# EAGLE design scr_precharge (EAGLE 7.6.0)
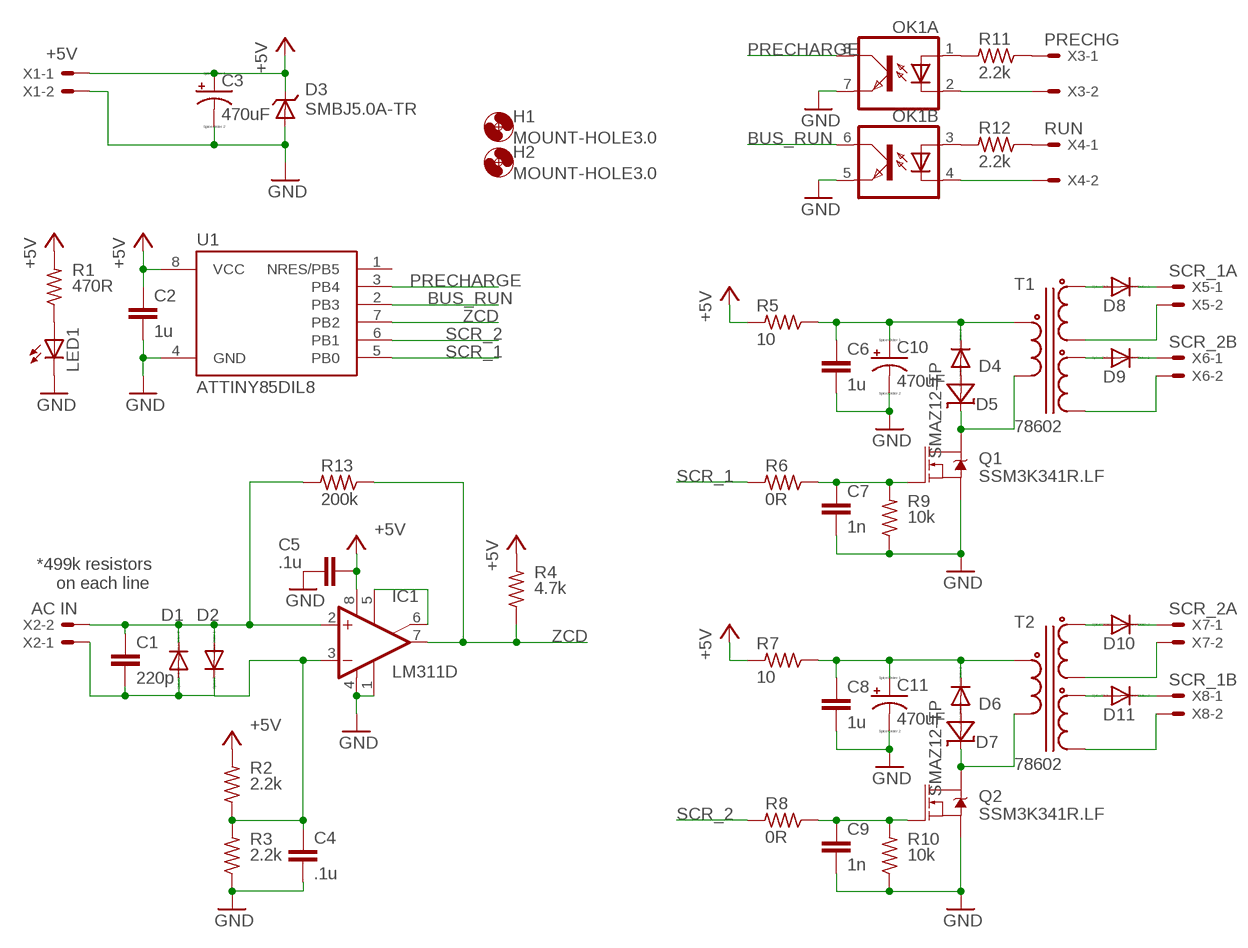
[diagram p0: schematic, sheet 1]

## Parts
C1  220p  C-EUC0805  [C0805]
C2  1u  C-EUC0805  [C0805]
C3  470uF  CPOL-USE3.5-8  [E3,5-8]
C4  .1u  C-EUC0805  [C0805]
C5  .1u  C-EUC0805  [C0805]
C6  1u  C-EUC0805  [C0805]
C7  1n  C-EUC0805  [C0805]
C8  1u  C-EUC0805  [C0805]
C9  1n  C-EUC0805  [C0805]
C10  470uF  CPOL-USE3.5-8  [E3,5-8]
C11  470uF  CPOL-USE3.5-8  [E3,5-8]
D1  1N4148MICROMELF  [MICROMELF-W]
D2  1N4148MICROMELF  [MICROMELF-W]
D3  SMBJ5.0A-TR  [DO214AA]
D4  1N4148MICROMELF  [MICROMELF-W]
D5  SMAZ12-TP  [DO-214AC]
D6  1N4148MICROMELF  [MICROMELF-W]
D7  SMAZ12-TP  [DO-214AC]
D8  1N4148MICROMELF  [MICROMELF-W]
D9  1N4148MICROMELF  [MICROMELF-W]
D10  1N4148MICROMELF  [MICROMELF-W]
D11  1N4148MICROMELF  [MICROMELF-W]
H1  MOUNT-HOLE3.0  [3,0]
H2  MOUNT-HOLE3.0  [3,0]
IC1  LM311D  [SO08]
LED1  LEDCHIP-LED0805  [CHIP-LED0805]
OK1  ILD621  [DIL08]
Q1  SSM3K341R.LF  MOSFET-NCH-AO3404A  [SOT23-3]
Q2  SSM3K341R.LF  MOSFET-NCH-AO3404A  [SOT23-3]
R1  470R  R-US_R0805  [R0805]
R2  2.2k  R-US_R0805  [R0805]
R3  2.2k  R-US_R0805  [R0805]
R4  4.7k  R-US_R0805  [R0805]
R5  10  R-US_R2010  [R2010]
R6  0R  R-US_R0805  [R0805]
R7  10  R-US_R2010  [R2010]
R8  0R  R-US_R0805  [R0805]
R9  10k  R-US_R0805  [R0805]
R10  10k  R-US_R0805  [R0805]
R11  2.2k  R-US_R0805  [R0805]
R12  2.2k  R-US_R0805  [R0805]
R13  200k  R-US_R0805  [R0805]
T1  78602  [J-STD-020D]
T2  78602  [J-STD-020D]
U1  ATTINY85DIL8  [DIL8]
X1  +5V  22-23-2021  [22-23-2021]
X2  AC IN  22-23-2021  [22-23-2021]
X3  PRECHG  22-23-2021  [22-23-2021]
X4  RUN  22-23-2021  [22-23-2021]
X5  SCR_1A  22-23-2021  [22-23-2021]
X6  SCR_2B  22-23-2021  [22-23-2021]
X7  SCR_2A  22-23-2021  [22-23-2021]
X8  SCR_1B  22-23-2021  [22-23-2021]

## Nets
+5V: C2.1 C3.+ C5.2 D3.C IC1.8(V+) R1.2 R2.2 R4.2 R5.2 R7.2 U1.8(VCC) X1.1
BUS_RUN: OK1.6(B:COL) U1.2(PB3)
GND: C2.2 C3.- C4.2 C5.1 C6.2 C7.2 C8.2 C9.2 C10.- C11.- D3.A IC1.1(GND) IC1.4(V-) LED1.C OK1.5(B:EMIT) OK1.7(A:EMIT) Q1.2(S) Q2.2(S) R3.1 R9.1 R10.1 U1.4(GND) X1.2
N$1: OK1.1(A:A) R11.2
N$2: D4.A D5.A
N$3: C6.1 C10.+ D4.C R5.1 T1.P$1
N$4: D8.A T1.P$2
N$5: D5.C Q1.3(D) T1.P$6
N$6: D8.C X5.1
N$7: T1.P$5 X5.2
N$8: T1.P$4 X6.2
N$9: D9.C X6.1
N$10: D9.A T1.P$3
N$11: C8.1 C11.+ D6.C R7.1 T2.P$1
N$12: D7.C Q2.3(D) T2.P$6
N$13: D6.A D7.A
N$14: D10.A T2.P$2
N$15: D10.C X7.1
N$16: T2.P$5 X7.2
N$17: T2.P$4 X8.2
N$18: D11.C X8.1
N$19: D11.A T2.P$3
N$20: C1.1 D1.C D2.A IC1.2(+IN) R13.2 X2.2
N$21: LED1.A R1.1
N$22: OK1.3(B:A) R12.2
N$23: R12.1 X4.1
N$24: R11.1 X3.1
N$25: OK1.4(B:C) X4.2
N$26: OK1.2(A:C) X3.2
N$27: C7.1 Q1.1(G) R6.1 R9.2
N$28: C9.1 Q2.1(G) R8.1 R10.2
N$29: C1.2 C4.1 D1.A D2.C IC1.3(-IN) R2.1 R3.2 X2.1
N$59: IC1.5(ON) IC1.6(ON/STR)
PRECHARGE: OK1.8(A:COL) U1.3(PB4)
SCR_1: R6.2 U1.5(PB0)
SCR_2: R8.2 U1.6(PB1)
ZCD: IC1.7(OUT) R4.1 R13.1 U1.7(PB2)
Unconnected: U1.1(NRES/PB5)

## Notes on the sheet
- *499k resistors
      on each line

## Library data of the parts
C1 C2 C4-C9 = resistor:C-EU: CAPACITOR, European symbol
C3 C10 C11 = resistor:CPOL-US: POLARIZED CAPACITOR, American symbol
D1 D2 D4 D6 D8-D11 = diode:1N4148: DIODE high speed (Philips)
D3 = diode:SMBJ5.0A-TR: TVS DIODE 5V 13.4V SMB 9.2V Clamp 68A Ipp Tvs Diode Surface Mount SMB (DO-214AA)
D5 D7 = diode:SMAZ12-TP: Zener Diode 12V 1W ±5% Surface Mount DO-214AC (SMAJ)
H1 H2 = holes:MOUNT-HOLE: MOUNTING HOLE with drill center marker
IC1 = linear:LM311: COMPARATOR
LED1 = led:LED: LED OSRAM: - CHIPLED LG R971, LG N971, LY N971, LG Q971, LY Q971, LO R971, LY R971 LH N974, LH R974 LS Q976, LO Q976, LY Q976 LO Q996 - Hyper CHIPLED LW Q18S LB Q993, LB Q99A, LB R99A - SideLED LS A670, LO A670, LY A670, LG A670, LP A670 LB A673, LV A673, LT A673, LW A673 LH A674 LY A675 LS A676, LA A676, LO A676, LY A676, LW A676 LS A679, LY A679, LG A679 - Hyper Micro SIDELED® LS Y876, LA Y876, LO Y876, LY Y876 LT Y87S - SmartLED LW L88C, LW L88S LB L89C, LB L89S, LG L890 LS L89K, LO L89K, LY L89K LS L896, LA L896, LO L896, LY L896 - TOPLED LS T670, LO T670, LY T670, LG T670, LP T670 LSG T670, LSP T670, LSY T670, LOP T670, LYG T670 LG T671, LOG T671, LSG T671 LB T673, LV T673, LT T673, LW T673 LH T674 LS T676, LA T676, LO T676, LY T676, LB T676, LH T676, LSB T676, LW T676 LB T67C, LV T67C, LT T67C, LS T67K, LO T67K, LY T67K, LW E67C LS E67B, LA E67B, LO E67B, LY E67B, LB E67C, LV E67C, LT E67C LW T67C LS T679, LY T679, LG T679 LS T770, LO T770, LY T770, LG T770, LP T770 LB T773, LV T773, LT T773, LW T773 LH T774 LS E675, LA E675, LY E675, LS T675 LS T776, LA T776, LO T776, LY T776, LB T776 LHGB T686 LT T68C, LB T68C - Hyper Mini TOPLED® LB M676 - Mini TOPLED Santana® LG M470 LS M47K, LO M47K, LY M47K Source: http://www.osram.convergy.de LUXEON: - LUMILED® LXK2-PW12-R00, LXK2-PW12-S00, LXK2-PW14-U00, LXK2-PW14-V00 LXK2-PM12-R00, LXK2-PM12-S00, LXK2-PM14-U00 LXK2-PE12-Q00, LXK2-PE12-R00, LXK2-PE12-S00, LXK2-PE14-T00, LXK2-PE14-U00 LXK2-PB12-K00, LXK2-PB12-L00, LXK2-PB12-M00, LXK2-PB14-N00, LXK2-PB14-P00, LXK2-PB14-Q00 LXK2-PR12-L00, LXK2-PR12-M00, LXK2-PR14-Q00, LXK2-PR14-R00 LXK2-PD12-Q00, LXK2-PD12-R00, LXK2-PD12-S00 LXK2-PH12-R00, LXK2-PH12-S00 LXK2-PL12-P00, LXK2-PL12-Q00, LXK2-PL12-R00 Source: www.luxeon.com KINGBRIGHT: KA-3528ASYC Source: www.kingbright.com
OK1 = optocoupler:ILD621: SIEMENS OPTO COUPLER; MF: VISHAY/TELEFUNKEN; MPN: ILD621; OC_FARNELL: 1020151; OC_NEWARK: 58K1678
Q1 Q2 = SparkFun-DiscreteSemi:MOSFET-NCH: N-channel MOSFETs Voltage controlled devices that allow control of high current outputs. SparkFun Products: SparkFun OpenScale <https://www.sparkfun.com/products/13261> SparkFun Digital Sandbox <https://www.sparkfun.com/products/12651> SparkFun Monster Moto Shield <https://www.sparkfun.com/products/10182> SparkFun MOSFET Power Controller <https://www.sparkfun.com/products/11214>; PROD_ID: TRANS-12988; VALUE: 5.8A/30V/35mΩ
R1-R13 = resistor:R-US_: RESISTOR, American symbol
T1 T2 = Alex:78602: XFRMR 1:1:1 56VUS SMD TOROID 10mH General Purpose Pulse Transformer 1:1:1 Surface Mount
U1 = attiny85:ATTINY85: ATMEL ATtiny 85
X1-X8 = con-molex:22-23-2021: .100" (2.54mm) Center Header - 2 Pin; MF: MOLEX; MPN: 22-23-2021; OC_FARNELL: 1462926; OC_NEWARK: 25C3832

## Board
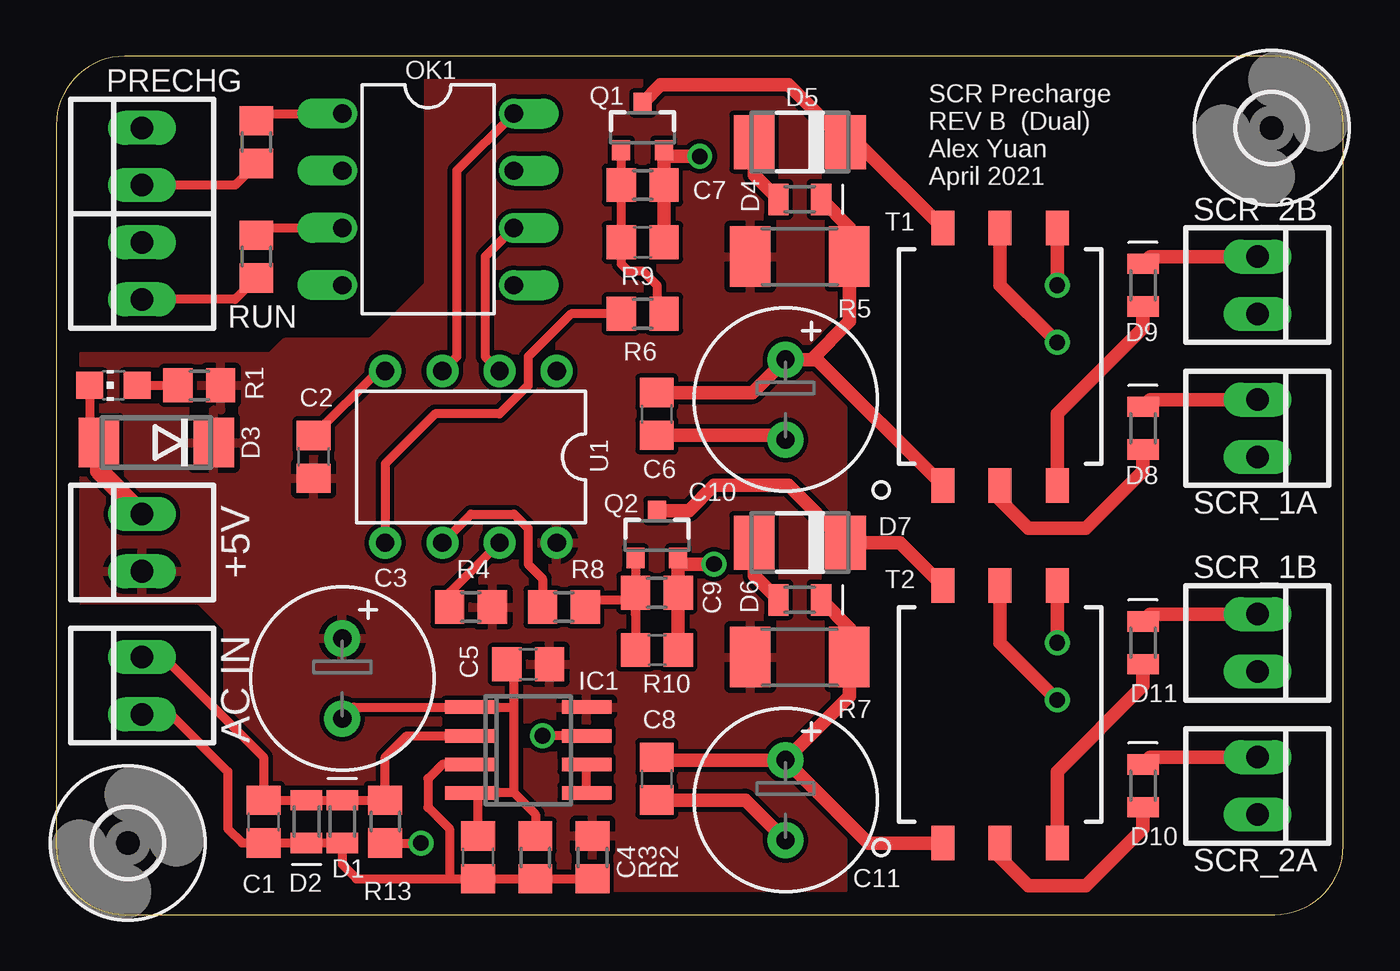
[diagram p1: board, top side]
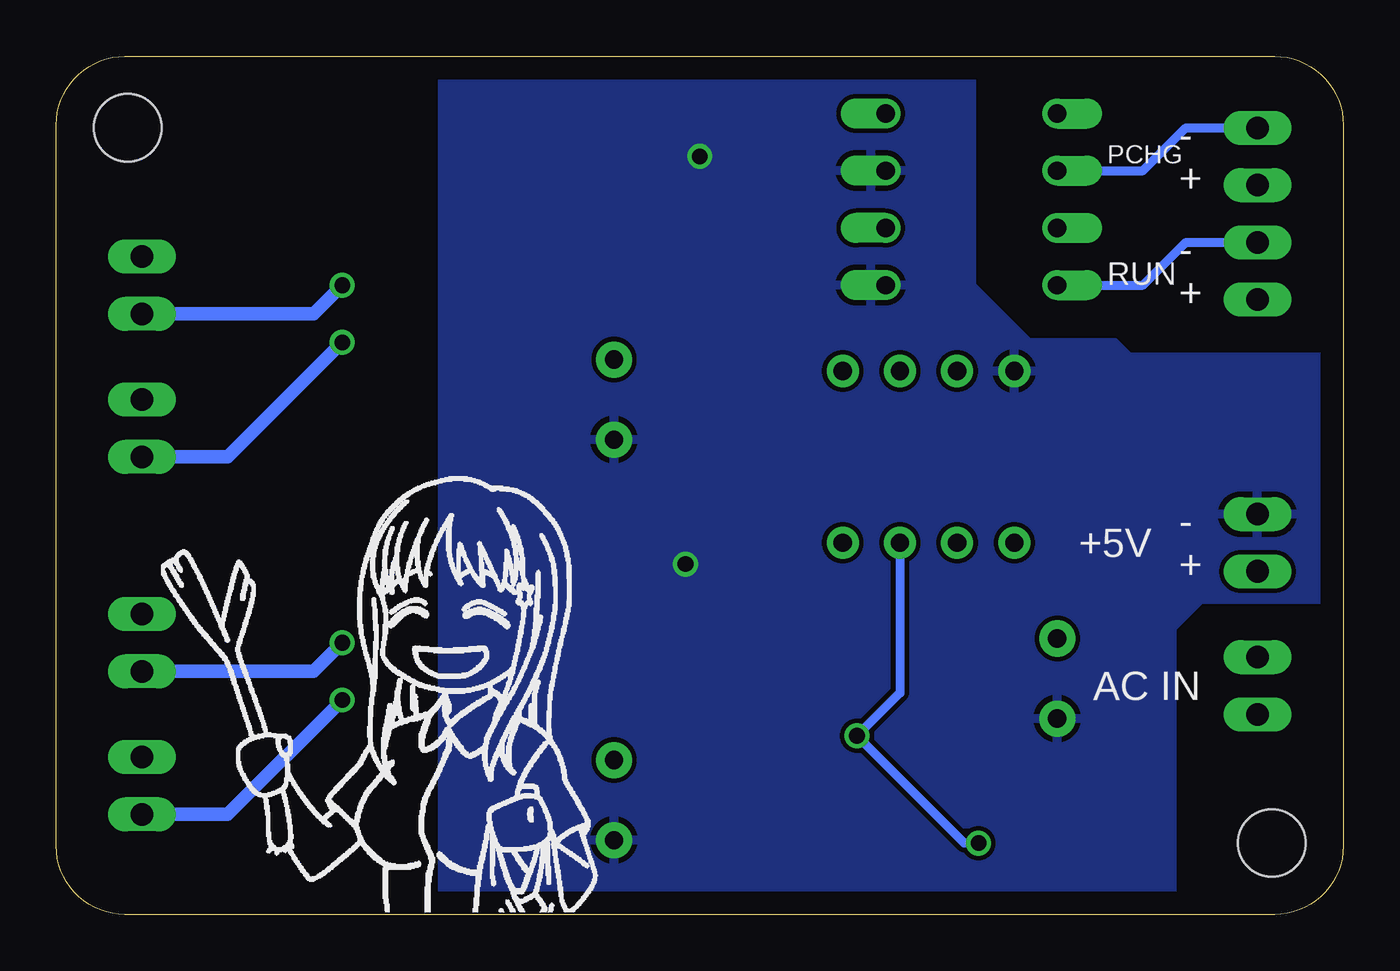
[diagram p2: board, bottom side, seen from below]

Size 57.15 x 38.1 mm. Coordinates in mm from the lower left corner, seen from the top.
Outline: 0,35.05 0,3.05 arc90 3.05,0 54.1,0 arc90 57.15,3.05 57.15,35.05 arc90 54.1,38.1 3.05,38.1 arc90 0,35.05
Copper layers (1*16): Top 0.035mm / dielectric 1.5mm / Bottom 0.035mm
Design rules "default": minimum track width 10mil, minimum drill 24mil, track to track 8mil, track to pad 8mil, pad to pad 8mil, via to via 8mil, smd to smd 8mil, copper to edge 40mil, drill to drill 8mil, minimum pad ring 10mil, minimum via ring 8mil, stop-mask expansion 4mil, vias tented up to drill 0mil, thermal gap 10mil

### Footprints (pad centres in the part's own frame; a part is rotated, then mirrored left to right if it is on the bottom)
C0805 = smd 1.3 x 1.5: 1 -0.95,0; 2 0.95,0
E3,5-8 = drill 0.813 pad 1.6: + -1.778,0; - 1.778,0
MICROMELF-W = smd 0.9 x 1.4: A 0.95,0; C -0.95,0
DO214AA = smd 1.8 x 2.2: A 2.55,0; C -2.55,0
DO-214AC = smd 1.8 x 2.4: A 2.025,0; C -2.025,0
3,0 = hole 3: 0,0
SO08 = smd 0.6 x 2.2: 1 -1.905,-2.6; 2 -0.635,-2.6; 3 0.635,-2.6; 4 1.905,-2.6; 5 1.905,2.6; 6 0.635,2.6; 7 -0.635,2.6; 8 -1.905,2.6
CHIP-LED0805 = smd 1.2 x 1.2: A 0,-1.05; C 0,1.05
DIL08 = drill 0.813 offset: 1 -3.81,-3.81; 2 -1.27,-3.81; 3 1.27,-3.81; 4 3.81,-3.81; 5 3.81,3.81; 6 1.27,3.81; 7 -1.27,3.81; 8 -3.81,3.81
SOT23-3 = smd 0.8 x 0.9: 1 -0.95,-1; 2 0.95,-1; 3 0,1.1
R0805 = smd 1.3 x 1.5: 1 -0.95,0; 2 0.95,0
R2010 = smd 1.8 x 2.7: 1 -2.2,0; 2 2.2,0
J-STD-020D = smd 1.524 x 1.016: P$1 -5.08,2.54; P$2 -5.08,0; P$3 -5.08,-2.54; P$4 6.35,-2.54; P$5 6.35,0; P$6 6.35,2.54
DIL8 = drill 0.813 pad 1.422: 1 -3.81,-3.81; 2 -1.27,-3.81; 3 1.27,-3.81; 4 3.81,-3.81; 5 3.81,3.81; 6 1.27,3.81; 7 -1.27,3.81; 8 -3.81,3.81
22-23-2021 = drill 1 long: 1 -1.27,0; 2 1.27,0

### Placement (x,y rotation side)
C1  9.21,4.13 270 top
C2  11.43,20.32 90 top
C3  12.7,10.48 270 top
C4  18.73,2.54 90 top
C5  20.95,11.11 0 top
C6  26.67,22.23 270 top
C7  26.04,29.84 0 top
C8  26.67,6.03 270 top
C9  26.67,11.75 0 top
C10  32.38,22.86 270 top
C11  32.38,5.08 270 top
D1  12.7,4.13 270 top
D2  11.11,4.13 90 top
D3  4.45,20.95 180 top
D4  33.02,31.75 180 top
D5  [DO-214AC]  33.02,34.29 180 top
D6  33.02,13.97 180 top
D7  [DO-214AC]  33.02,16.51 180 top
D8  48.26,21.59 270 top
D9  48.26,27.94 270 top
D10  48.26,5.71 270 top
D11  48.26,12.06 270 top
H1  53.98,34.92 0 top
H2  3.17,3.17 0 top
IC1  20.95,7.3 270 top
LED1  2.54,23.5 90 top
OK1  16.51,31.75 270 top
Q1  NTR5198NL  [SOT23-3]  26.04,34.92 0 top
Q2  NTR5198NL  [SOT23-3]  26.67,16.83 0 top
R1  6.35,23.5 0 top
R2  23.81,2.54 90 top
R3  21.27,2.54 270 top
R4  18.41,13.65 0 top
R5  33.02,29.21 180 top
R6  26.04,26.67 180 top
R7  33.02,11.43 180 top
R8  22.54,13.65 180 top
R9  26.04,32.38 180 top
R10  26.67,14.29 180 top
R11  8.89,34.29 90 top
R12  8.89,29.21 90 top
R13  14.61,4.13 90 top
T1  41.91,24.13 90 top
T2  41.91,8.26 90 top
U1  18.41,20.32 180 top
X1  3.81,16.51 90 top
X2  3.81,10.16 90 top
X3  3.81,33.66 90 top
X4  3.81,28.57 90 top
X5  53.34,21.59 270 top
X6  53.34,27.94 270 top
X7  53.34,5.71 270 top
X8  53.34,12.06 270 top

### Tracks (layer width: path | path; a pad name or v marks a point on that pad's centre or on a via)
+5V
  Top 0.406: 7.3,21.26 D3.C
  pour Top: 0,13.97 6.35,13.97 7.62,12.7 7.62,0 34.92,0 34.92,38.1 16.51,38.1 16.51,27.94 13.97,25.4 10.16,25.4 9.53,24.77 0,24.77
BUS_RUN
  Top 0.406: OK1.6 19.05,29.21 19.05,24.77 U1.2
GND  (via drill 0.7)
  Top 0.406: 20.32,5.4 20.32,9.21 | 20.32,9.21 20.32,10.8 C5.1 | 20.32,9.21 IC1.1 13.21,9.21 C3.- | LED1.C 1.49,21.36 D3.A | C2.2 14.29,24.13 U1.4 | 20.32,5.4 IC1.4 18.73,5.34 C4.2 | 20.32,5.4 21.27,4.45 R3.1
  Top 0.61: C7.2 R9.1 Q1.2 27.25,33.66 v28.57,33.66 | C9.2 R10.1 Q2.2 27.89,15.56 v29.21,15.56 | C6.2 32.19,21.27 C10.- | C8.2 30.61,5.08 C11.-
  Top 0.813: D3.A 1.9,19.7 X1.2
  pour Bottom: 0,13.97 6.35,13.97 7.62,12.7 7.62,0 40.01,0 40.01,38.1 16.51,38.1 16.51,27.94 13.97,25.4 10.16,25.4 9.53,24.77 0,24.77
N$1
  Top 0.406: R11.2 9.21,35.56 OK1.1
N$2
  Top 0.61: D4.A 31,32.83 D5.A
N$3
  Top 0.61: T1.P$1 33.78,24.64 C10.+ | C10.+ 33.53,24.64 35.22,26.33 R5.1 35.22,30.5 D4.C | C6.1 30.92,23.18 C10.+
N$4
  Top 0.61: T1.P$2 41.91,18.41 43.18,17.14 45.72,17.14 48.26,19.68 D8.A
N$5
  Top 0.61: T1.P$6 35.56,34.29 D5.C 32.51,36.83 26.84,36.83 Q1.3
N$6
  Top 0.61: D8.C 48.58,22.86 X5.1
N$7  (via drill 0.7)
  Top 0.61: T1.P$5 41.91,27.94 v44.45,25.4
  Bottom 0.61: v44.45,25.4 49.53,20.32 X5.2
N$8  (via drill 0.7)
  Top 0.61: T1.P$4 v44.45,27.94
  Bottom 0.61: X6.2 45.72,26.67 v44.45,27.94
N$9
  Top 0.61: X6.1 48.58,29.21 D9.C
N$10
  Top 0.61: T1.P$3 44.45,22.23 48.26,26.04 D9.A
N$11
  Top 0.61: D6.C 35.22,12.72 R7.1 35.22,9.69 C11.+ | T2.P$1 36.07,3.17 C11.+ | C8.1 26.79,6.86 C11.+
N$12
  Top 0.61: T2.P$6 37.47,16.51 D7.C 32.51,19.05 29.21,19.05 28.09,17.93 Q2.3
N$13
  Top 0.61: D7.A 31,15.04 D6.A
N$14
  Top 0.61: T2.P$2 41.91,2.54 43.18,1.27 45.72,1.27 48.26,3.81 D10.A
N$15
  Top 0.61: D10.C 48.58,6.99 X7.1
N$16  (via drill 0.7)
  Top 0.61: T2.P$5 41.91,12.06 v44.45,9.53
  Bottom 0.61: v44.45,9.53 49.53,4.45 X7.2
N$17  (via drill 0.7)
  Top 0.61: T2.P$4 v44.45,12.06
  Bottom 0.61: v44.45,12.06 45.72,10.79 X8.2
N$18
  Top 0.61: D11.C 48.58,13.34 X8.1
N$19
  Top 0.61: T2.P$3 44.45,6.35 48.26,10.16 D11.A
N$20
  Top 0.406: X2.2 4.76,11.43 9.21,6.99 C1.1 D2.A D1.C R13.2 14.61,6.99 15.56,7.94 IC1.2
N$21
  Top 0.406: LED1.A R1.1
N$22
  Top 0.406: R12.2 9.21,30.48 OK1.3
N$23
  Top 0.406: R12.1 7.93,27.3 X4.1
N$24
  Top 0.406: R11.1 7.93,32.38 X3.1
N$25
  Bottom 0.406: OK1.4 8.89,27.94 6.99,29.84 X4.2
N$26
  Bottom 0.406: OK1.2 8.89,33.02 6.99,34.92 X3.2
N$27
  Top 0.406: Q1.1 R9.2 C7.1 25.09,28.89 25.4,28.57 26.04,28.57 26.67,27.94 26.67,26.98 R6.1
N$28
  Top 0.406: Q2.1 R10.2 | R10.2 C9.1 | 25.72,13.34 R10.2 | R8.1 23.81,13.97 25.4,13.97 R10.2
N$29
  Top 0.406: X2.1 5.08,8.89 7.62,6.35 7.62,3.81 8.25,3.18 C1.2 D2.C D1.A 12.7,2.22 13.34,1.59 17.46,1.59 | C4.1 R3.2 R2.1 | 17.46,1.59 18.41,1.59 C4.1 | C4.1 | IC1.3 17.14,6.67 16.51,6.03 16.51,4.76 17.46,3.81 17.46,1.59
N$59
  Top 0.406: IC1.5 IC1.6
PRECHARGE
  Top 0.406: OK1.8 17.78,33.02 17.78,24.77 U1.3
SCR_1
  Top 0.406: R6.2 22.86,26.67 20.95,24.77 20.95,23.5 19.68,22.23 16.83,22.23 14.61,20 U1.5
SCR_2
  Top 0.406: U1.6 18.41,17.78 20.32,17.78 20.95,17.14 20.95,15.55 21.59,14.92 R8.2
ZCD  (via drill 0.7)
  Top 0.406: IC1.7 v21.59,7.94 | U1.7 17.46,14.29 R4.1 | R13.1 v16.19,3.17
  Bottom 0.406: U1.7 19.68,9.84 v21.59,7.94 16.83,3.17 v16.19,3.17

### Text on the board
tNames: SCR Precharge / REV B (Dual) / Alex Yuan / April 2021
bNames: PCHG | - / + | RUN | - / + | +5V | - / + | AC IN